# EAGLE design MVP (EAGLE 7.5.0)
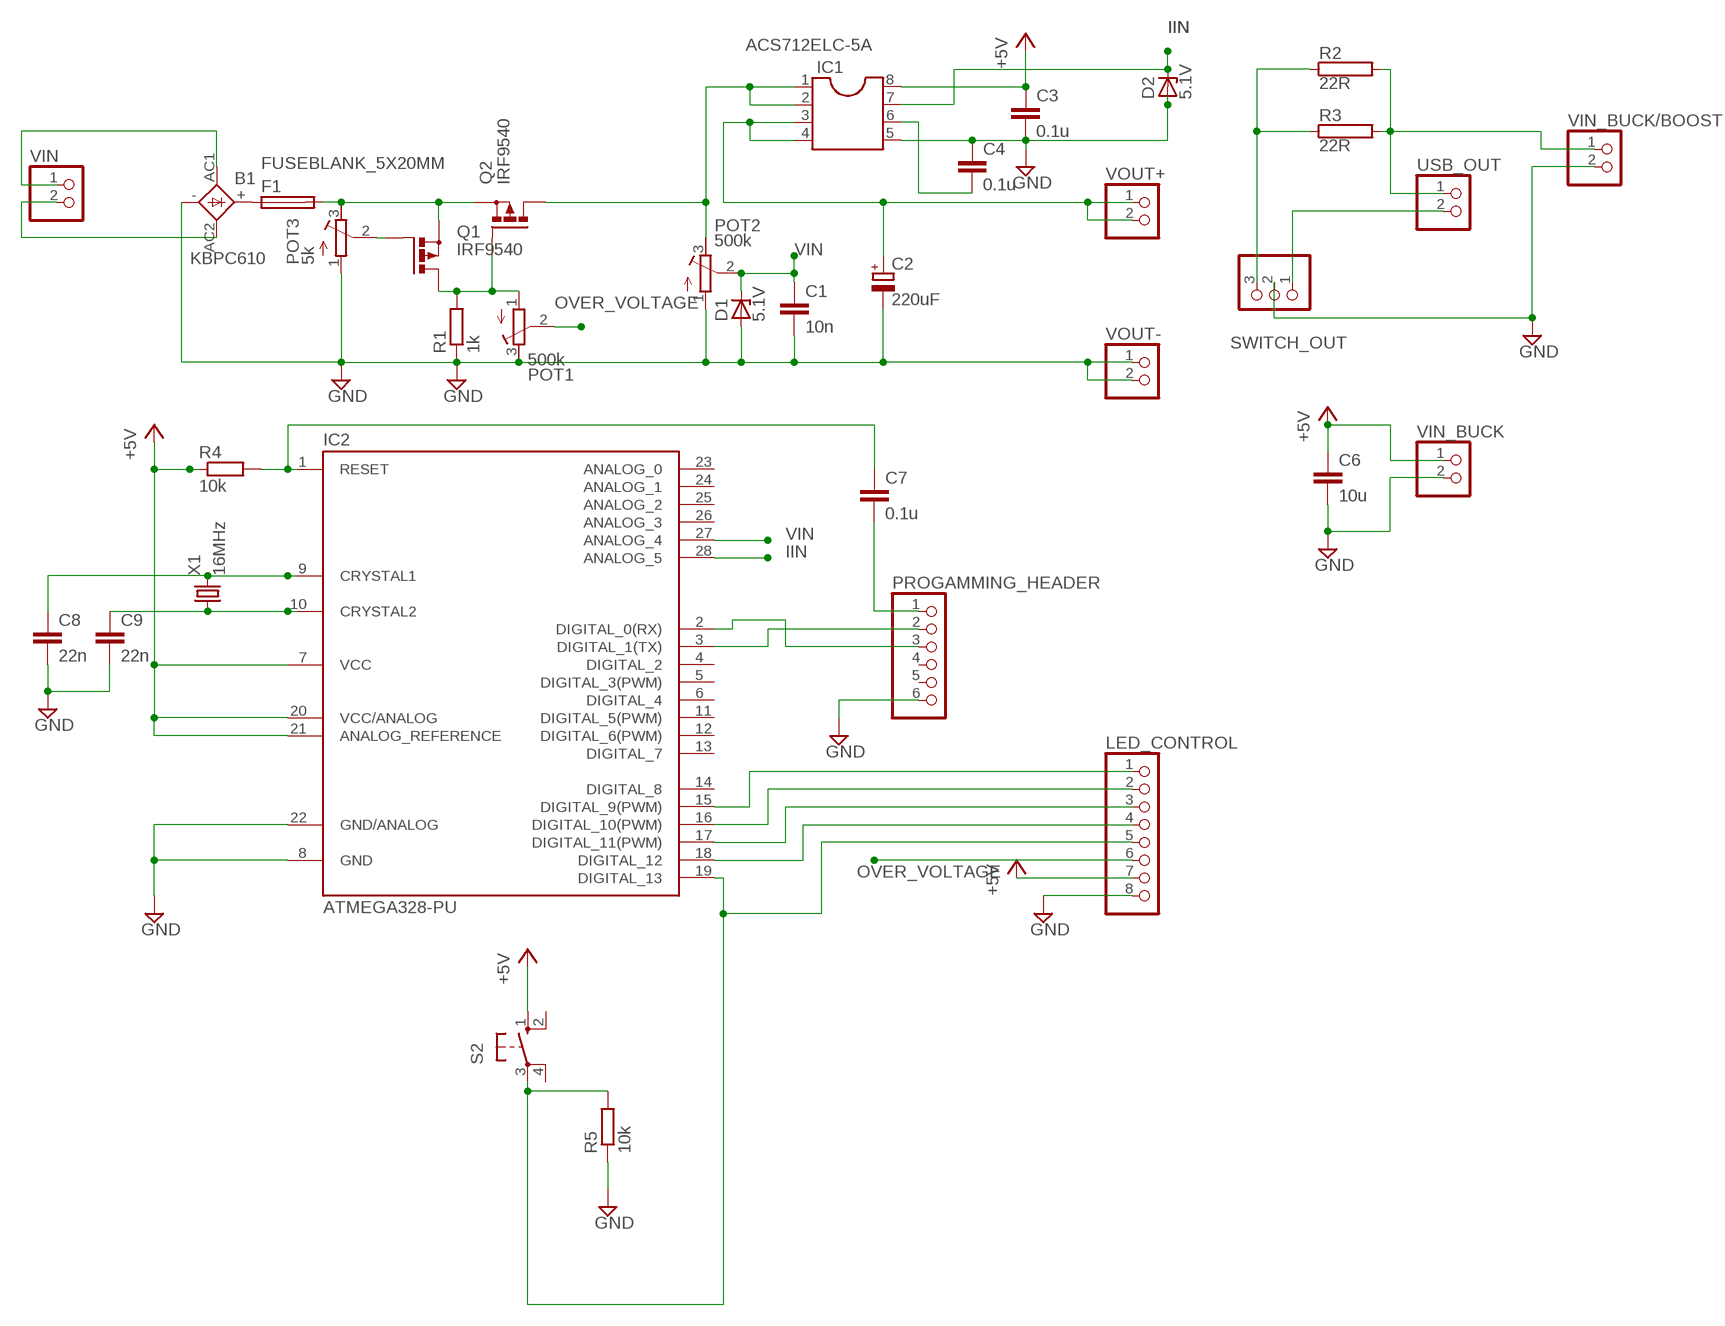
[diagram p0: schematic, sheet 1]

## Parts
B1  KBPC610  GBPC6  [GBPC6]
C1  10n  C-EUC1206K  [C1206K]
C2  220uF  CPOL-EUE3.5-10  [E3,5-10]
C3  0.1u  C-EUC1206K  [C1206K]
C4  0.1u  C-EUC1206K  [C1206K]
C6  10u  C-EUC1206K  [C1206K]
C7  0.1u  C-EUC1206K  [C1206K]
C8  22n  C-EUC0805K  [C0805K]
C9  22n  C-EUC0805K  [C0805K]
D1  5.1V  ZPD  [DO35Z10]
D2  5.1V  ZPD  [DO35Z10]
F1  FUSEBLANK_5X20MM  [FUSE_HOLDER_5X20MM]
IC1  ACS712ELC-5A  SOIC8  [SOIC8]
IC2  ATMEGA328-PU  ATMEGA168-PU  [DIL28-3]
LED_CONTROL  PINHD-1X8  [1X08]
POT1  500k  R-TRIMM3296W  [RTRIM3296W]
POT2  500k  R-TRIMM3296W  [RTRIM3296W]
POT3  5k  R-TRIMM3296W  [RTRIM3296W]
PROGAMMING_HEADER  PINHD-1X6  [1X06]
Q1  IRF9540  PMOSFET_PTO220BV  [TO220BV]
Q2  IRF9540  PMOSFET_PTO220BV  [TO220BV]
R1  1k  R-EU_VTA52  [VTA52]
R2  22R  RRWM8X45  [RWM8X45]
R3  22R  RRWM8X45  [RWM8X45]
R4  10k  R-EU_R1206  [R1206]
R5  10k  R-EU_R1206  [R1206]
S2  10-XX  [B3F-10XX]
SWITCH_OUT  PINHD-1X3  [1X03]
USB_OUT  PINHD-1X2  [1X02]
VIN  PINHD-1X2  [1X02]
VIN_BUCK  PINHD-1X2  [1X02]
VIN_BUCK/BOOST  PINHD-1X2  [1X02]
VOUT+  PINHD-1X2  [1X02]
VOUT-  PINHD-1X2  [1X02]
X1  16MHz  CRYSTALHC49S  [HC49/S]

## Nets
+5V: C3.1 C6.1 IC1.8 IC2.7(VCC) IC2.20(VCC/ANALOG) IC2.21(ANALOG_REFERENCE) LED_CONTROL.7 R4.1 S2.1(S) VIN_BUCK.1
GND: B1.- C1.2 C2.- C3.2 C4.1 C6.2 C8.2 C9.2 D1.A D2.A IC1.5 IC2.8(GND) IC2.22(GND/ANALOG) LED_CONTROL.8 POT1.3(E) POT2.1(A) POT3.1(A) PROGAMMING_HEADER.6 R1.1 R5.1 SWITCH_OUT.2 VIN_BUCK.2 VIN_BUCK/BOOST.2 VOUT-.1 VOUT-.2
IIN: D2.C IC1.7 IC2.28(ANALOG_5)
M1S: C2.+ IC1.3 IC1.4 VOUT+.1 VOUT+.2
N$1: B1.+ F1.1
N$2: C4.2 IC1.6
N$3: IC1.1 IC1.2 POT2.3(E) Q2.D
N$4: IC2.3(DIGITAL_1(TX)) PROGAMMING_HEADER.2
N$5: IC2.2(DIGITAL_0(RX)) PROGAMMING_HEADER.3
N$6: IC2.15(DIGITAL_9(PWM)) LED_CONTROL.1
N$7: POT3.2(S) Q1.G
N$8: IC2.19(DIGITAL_13) LED_CONTROL.5 R5.2 S2.3(P)
N$9: IC2.16(DIGITAL_10(PWM)) LED_CONTROL.2
N$10: F1.2 POT3.3(E) Q1.S Q2.S
N$11: IC2.17(DIGITAL_11(PWM)) LED_CONTROL.3
N$12: IC2.18(DIGITAL_12) LED_CONTROL.4
N$14: C7.2 PROGAMMING_HEADER.1
N$15: C9.1 IC2.10(CRYSTAL2) X1.1
N$16: C8.1 IC2.9(CRYSTAL1) X1.2
N$17: C7.1 IC2.1(RESET) R4.2
N$19: B1.AC2 VIN.2
N$20: B1.AC1 VIN.1
N$23: R2.2 R3.2 USB_OUT.1 VIN_BUCK/BOOST.1
N$24: R2.1 R3.1 SWITCH_OUT.3
N$25: SWITCH_OUT.1 USB_OUT.2
N$35: POT1.1(A) Q1.D Q2.G R1.2
OVER_VOLTAGE: LED_CONTROL.6 POT1.2(S)
VIN: C1.1 D1.C IC2.27(ANALOG_4) POT2.2(S)
Unconnected: IC2.4(DIGITAL_2) IC2.5(DIGITAL_3(PWM)) IC2.6(DIGITAL_4) IC2.11(DIGITAL_5(PWM)) IC2.12(DIGITAL_6(PWM)) IC2.13(DIGITAL_7) IC2.14(DIGITAL_8) IC2.23(ANALOG_0) IC2.24(ANALOG_1) IC2.25(ANALOG_2) IC2.26(ANALOG_3) PROGAMMING_HEADER.4 PROGAMMING_HEADER.5 S2.2(S1) S2.4(P1)

## Library data of the parts
B1 = rectifier:GBPC6: GENERAL INSTRUMENT RECTIFIER
C1 C3 C4 C6-C9 = resistor:C-EU: CAPACITOR, European symbol
C2 = resistor:CPOL-EU: POLARIZED CAPACITOR, European symbol
D1 D2 = diode:ZPD: Z DIODE 500 mW
F1 = fuse:FUSE: Fuse; OC_FARNELL: unknown; OC_NEWARK: unknown
IC1 = mylibrary:SOIC8: Dual In Line / Socket
IC2 = Arduino-AVR:ATMEGA168-PU
LED_CONTROL = pinhead:PINHD-1X8: PIN HEADER
POT1-POT3 = resistor:R-TRIMM: Trimm resistor
PROGAMMING_HEADER = pinhead:PINHD-1X6: PIN HEADER
Q1 Q2 = transistor-power:PMOSFET_P: Power MOSFET P-Channel
R1 R4 R5 = resistor:R-EU_: RESISTOR, European symbol
R2 R3 = resistor-power:R: Power Resitor; OC_FARNELL: unknown; OC_NEWARK: unknown
S2 = switch-omron:10-XX: OMRON SWITCH; MPN: B3F-1000; OC_FARNELL: 176432; OC_NEWARK: 36M3542
SWITCH_OUT = pinhead:PINHD-1X3: PIN HEADER
USB_OUT VIN VIN_BUCK VIN_BUCK/BOOST VOUT+ VOUT- = pinhead:PINHD-1X2: PIN HEADER
X1 = crystal:CRYSTAL: CRYSTAL; OC_FARNELL: 1667008; OC_NEWARK: unknown

## Module BB1
Ports: 

### Library data of the parts

## Board
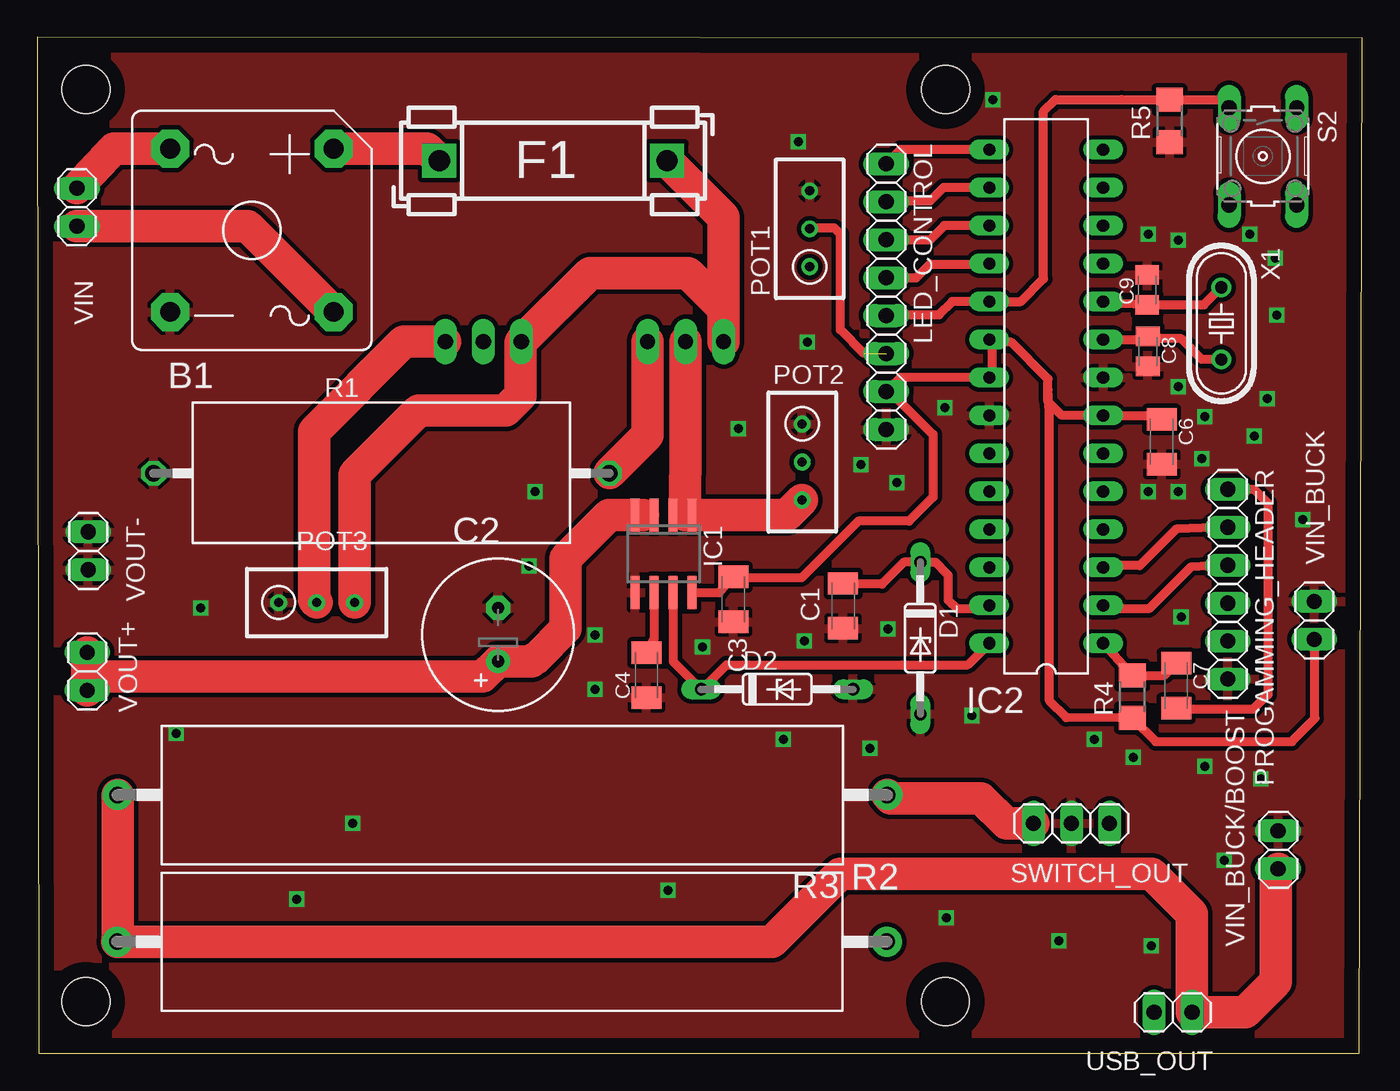
[diagram p1: board, top side]
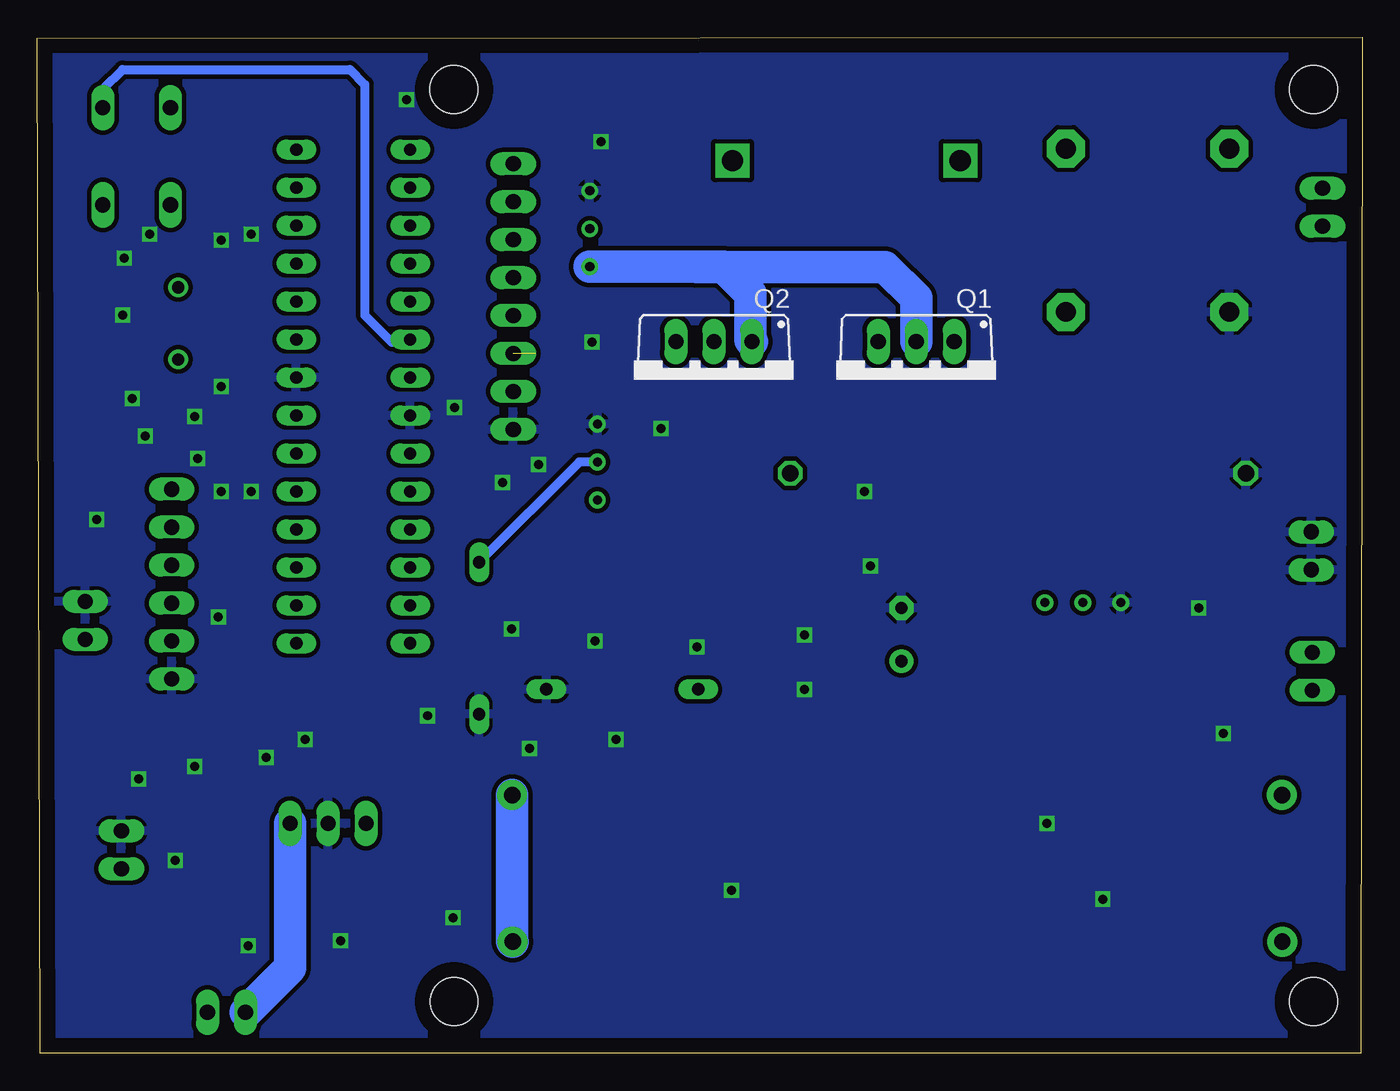
[diagram p2: board, bottom side, seen from below]

Size 88.61 x 67.95 mm. Coordinates in mm from the lower left corner, seen from the top.
Outline: 0.11,0 88.4,0.01 88.61,67.88 0,67.95 0.11,0
Copper layers (1*16): Top 0.035mm / dielectric 1.5mm / Bottom 0.035mm
Design rules "default": minimum track width 10mil, minimum drill 24mil, track to track 8mil, track to pad 8mil, pad to pad 8mil, via to via 8mil, smd to smd 8mil, copper to edge 40mil, drill to drill 8mil, minimum pad ring 10mil, minimum via ring 8mil, stop-mask expansion 4mil, vias tented up to drill 0mil, thermal gap 10mil
Holes 3.2 mm at 3.24,64.46 60.74,64.46 60.74,3.46 3.24,3.46

### Footprints (pad centres in the part's own frame; a part is rotated, then mirrored left to right if it is on the bottom)
GBPC6 = drill 1.321 pad 2.54 octagon: + 5.461,5.461; - -5.461,-5.461; AC1 -5.461,5.461; AC2 5.461,-5.461
C1206K = smd 1.5 x 2: 1 -1.5,0; 2 1.5,0
E3,5-10 = drill 0.813 pad 1.6: + -1.778,0 | drill 0.813 pad 1.6 octagon: - 1.778,0
C0805K = smd 1.3 x 1.6: 1 -1,0; 2 1,0
DO35Z10 = drill 0.813 long: A 5.08,0; C -5.08,0
FUSE_HOLDER_5X20MM = drill 1.422 pad 2.286 square: 1 0,0; 2 15.24,0
SOIC8 = smd 0.6 x 2.2: 1 -1.905,-2.6; 2 -0.635,-2.6; 3 0.635,-2.6; 4 1.905,-2.6; 5 1.905,2.6; 6 0.635,2.6; 7 -0.635,2.6; 8 -1.905,2.6
DIL28-3 = drill 0.813 long: 1 -16.51,-3.81; 2 -13.97,-3.81; 3 -11.43,-3.81; 4 -8.89,-3.81; 5 -6.35,-3.81; 6 -3.81,-3.81; 7 -1.27,-3.81; 8 1.27,-3.81; 9 3.81,-3.81; 10 6.35,-3.81; 11 8.89,-3.81; 12 11.43,-3.81; 13 13.97,-3.81; 14 16.51,-3.81; 15 16.51,3.81; 16 13.97,3.81; 17 11.43,3.81; 18 8.89,3.81; 19 6.35,3.81; 20 3.81,3.81; 21 1.27,3.81; 22 -1.27,3.81; 23 -3.81,3.81; 24 -6.35,3.81; 25 -8.89,3.81; 26 -11.43,3.81; 27 -13.97,3.81; 28 -16.51,3.81
1X08 = drill 1.016 long: 1 -8.89,0; 2 -6.35,0; 3 -3.81,0; 4 -1.27,0; 5 1.27,0; 6 3.81,0; 7 6.35,0; 8 8.89,0
RTRIM3296W = drill 0.61: 1 0,-2.54; 2 0,0; 3 0,2.54
1X06 = drill 1.016 long: 1 -6.35,0; 2 -3.81,0; 3 -1.27,0; 4 1.27,0; 5 3.81,0; 6 6.35,0
TO220BV = drill 1.016 long: D 0,-2.54; G -2.54,-2.54; S 2.54,-2.54
VTA52 = drill 1.1 octagon: 1 -15.24,0; 2 15.24,0
RWM8X45 = drill 1.1 pad 2: 1 -25.74,0; 2 25.74,0
R1206 = smd 1.6 x 1.803: 1 -1.422,0; 2 1.422,0
B3F-10XX = drill 1.016 long: 1 -3.251,2.261; 2 3.251,2.261; 3 -3.251,-2.261; 4 3.251,-2.261
1X03 = drill 1.016 long: 1 -2.54,0; 2 0,0; 3 2.54,0
1X02 = drill 1.016 long: 1 -1.27,0; 2 1.27,0
HC49/S = drill 0.813: 1 -2.413,0; 2 2.413,0

### Placement (x,y rotation side)
B1  14.35,55.05 0 top
C1  53.89,29.92 270 top
C2  30.81,28 90 top
C3  46.55,30.37 270 top
C4  40.74,25.29 90 top
C6  75.2,40.91 270 top
C7  76.17,24.58 270 top
C8  74.28,46.94 270 top
C9  74.22,51.07 90 top
D1  59.05,27.76 270 top
D2  49.48,24.35 0 top
F1  26.88,59.7 0 top
IC1  41.89,33.41 180 top
IC2  67.48,43.93 90 top
LED_CONTROL  56.78,50.61 270 top
POT1  51.66,55.15 0 top
POT2  51.15,39.55 180 top
POT3  18.68,30.15 270 top
PROGAMMING_HEADER  79.62,31.38 270 top
Q1  29.82,45.06 180 bottom
Q2  43.35,45.06 180 bottom
R1  23.02,38.8 0 top
R2  31.08,7.46 180 top
R3  31.1,17.27 180 top
R4  73.23,23.86 90 top
R5  75.73,62.36 90 top
S2  81.97,60 270 top
SWITCH_OUT  69.16,15.37 180 top
USB_OUT  75.96,2.75 180 top
VIN  2.65,56.59 270 top
VIN_BUCK  85.4,28.95 90 top
VIN_BUCK/BOOST  82.99,13.61 90 top
VOUT+  3.33,25.55 270 top
VOUT-  3.4,33.61 90 top
X1  79.19,48.82 270 top

### Tracks (layer width: path | path; a pad name or v marks a point on that pad's centre or on a via)
+5V
  Top 0.61: 67.6,44.38 67.6,43.59 68.53,42.66 IC2.7 74.8,42.66 C6.1 | 67.6,44.38 67.6,45.1 65.13,47.57 63.84,47.57 | 63.84,47.57 IC2.20 | 63.84,47.57 63.84,45.38 IC2.21 57.72,45.2 LED_CONTROL.7 57.04,44.26 59.9,41.4 59.9,37.2 58.3,35.6 54.9,35.6 51.1,31.8 46.62,31.8 C3.1 45.6,30.81 IC1.8 | 67.6,44.38 67.7,42.88 67.7,23.58 68.82,22.46 R4.1 73.23,22.41 74.79,20.85 83.9,20.85 85.45,22.4 85.45,27.64 VIN_BUCK.1
  Bottom 0.61: S2.1 84.23,64.47 82.9,65.8 67.7,65.8 66.7,64.8 66.7,49.37 64.9,47.57 63.84,47.57 IC2.20
GND  (via drill 0.6)
  other vias: 44.5,27.18 51.3,27.58 56.89,28.38 57.5,38.18 62.5,22.58 79.4,12.9 74.5,7.18 55.7,20.38 21.1,15.38 42.19,10.91 73.3,19.78 68.32,7.51 37.31,24.34 17.34,10.31 78.1,19.18 60.81,9.05 84.64,35.7 82.26,43.81 76.3,37.58 74.3,37.58 78.1,42.58 77.9,39.78 82.9,49.38 74.3,54.78 76.3,54.38 81.1,54.78 76.3,44.58 82.81,53.18 81.38,41.28 63.9,63.78 50.9,60.98 51.5,47.58 46.9,41.78 55.1,39.38 33.3,37.58 10.91,29.78 9.3,21.38 81.82,18.36 76.5,29.18 70.7,20.98 32.9,32.58 37.3,27.98 49.9,20.98 60.7,43.18
  pour Top (isolate 0.3): -1.53,68.61 -1.73,-1.69 90.23,-2.18 90.43,68.14
  pour Bottom (isolate 0.3): -1.69,68.57 -1.69,-1.87 90.25,-2.2 90.25,68.46
IIN
  Top 0.61: IC2.28 62.22,25.98 46.1,25.98 44.8,24.68 D2.C 42.53,26.22 IC1.7
M1S
  Top 0.61: IC1.3 40.5,36.01
  Top 2.184: 3.33,25.21 VOUT+.1 | 40.5,36 40.5,36.01 IC1.4 38.25,36.01 35.34,33.1 35.34,28.41 33.34,26.41 33.24,26.41 33.04,26.21 30.82,26.21 C2.+ 29.77,25.19 5.64,25.19 3.33,25.21 | VOUT+.2 3.33,25.21
N$1
  Top 2.184: B1.+ 26.07,60.51 F1.1
N$2
  Top 0.61: IC1.6 41.26,27.74 C4.2
N$3
  Top 0.61: IC1.2 43.3,36.01 43.3,36
  Top 2.184: POT2.3 50.15,36.01 IC1.1 43.3,36.1 | Q2.D 43.35,39.35 43.3,38 43.3,36.1 | 43.3,36.1 43.3,36
N$4
  Top 0.61: PROGAMMING_HEADER.2 76.18,35.07 74.7,33.58 73.74,32.62 71.4,32.62 IC2.3
N$5
  Top 0.61: PROGAMMING_HEADER.3 77.14,32.53 74.34,29.73 71.52,29.73 IC2.2
N$6
  Top 0.61: IC2.15 57.72,60.44 LED_CONTROL.1
N$7
  Top 2.184: Q1.G 24.5,47.6 18.5,41.6 18.5,30.32 POT3.2
N$8
  Top 0.61: LED_CONTROL.5 56.84,49.4 60.3,49.4 61.19,50.28 IC2.19 65.79,50.28 67.3,51.8 67.3,63 68.1,63.8 72.51,63.8 R5.2 79.24,63.78 S2.3
N$9
  Top 0.61: IC2.16 60.61,57.9 59.7,57 56.82,57 LED_CONTROL.2
N$10
  Top 2.184: F1.2 45.89,55.92 Q2.S 45.89,49.81 43.5,52.2 36.96,52.2 Q1.S 32.3,47.54 32.3,44 31.3,43 25.5,43 21.22,38.72 POT3.3
N$11
  Top 0.61: IC2.17 60.67,55.36 59.7,54.4 56.8,54.4 LED_CONTROL.3
N$12
  Top 0.61: LED_CONTROL.4 58.79,51.88 59.7,52.8 63.64,52.8 IC2.18
N$14
  Top 0.61: PROGAMMING_HEADER.1 81.37,37.73 82.3,36.8 82.3,24 81.3,23 76.25,23 C7.2
N$15
  Top 0.61: IC2.10 71.38,50.19 C9.1 78.02,50.07 X1.1
N$16
  Top 0.61: IC2.9 74.09,47.74 C8.1 74.42,47.8 76.5,47.8 77.89,46.41 X1.2
N$17
  Top 0.61: IC2.1 71.43,27.28 R4.2 75.37,25.28 C7.1
N$19
  Top 2.184: VIN.2 14.08,55.32 B1.AC2
N$20
  Top 2.184: B1.AC1 5.1,60.51 VIN.1
N$23
  Top 2.184: R3.2 5.36,7.48 R2.2 49.13,7.46 53.68,12.01 74.53,12.01 77.2,9.34 77.2,2.77 USB_OUT.1 80.81,2.75 82.83,4.77 82.83,12.19 VIN_BUCK/BOOST.1
N$24
  Top 2.184: SWITCH_OUT.3 64.81,15.37 63.12,17.06 57.06,17.06 R3.1
  Bottom 2.184: R3.1 56.84,7.48 R2.1
N$25
  Bottom 2.184: SWITCH_OUT.1 71.7,5.73 USB_OUT.2
N$35
  Top 2.184: Q2.G 40.81,41.35 R1.2
  Bottom 2.184: POT1.1 44.5,52.61 | 44.5,52.61 42.72,52.61 40.9,50.8 40.9,47.69 Q2.G | Q1.D 29.82,50.52 31.9,52.6 44.49,52.6 44.5,52.61
OVER_VOLTAGE  (1 unrouted)
  Top 0.61: 55.3,46.8 53.7,48.4 53.7,54.8 53.3,55.2 51.71,55.2 POT1.2
VIN
  Top 0.61: IC2.27 63.44,29.74 61.49,29.74 60.91,30.32 60.91,31.98 60.05,32.84 D1.C 57.96,32.84 56.5,31.38 53.95,31.38 C1.1
  Bottom 0.61: POT2.2 52.35,39.55 D1.C